# EAGLE design rpi_hat (EAGLE 6.6.0)
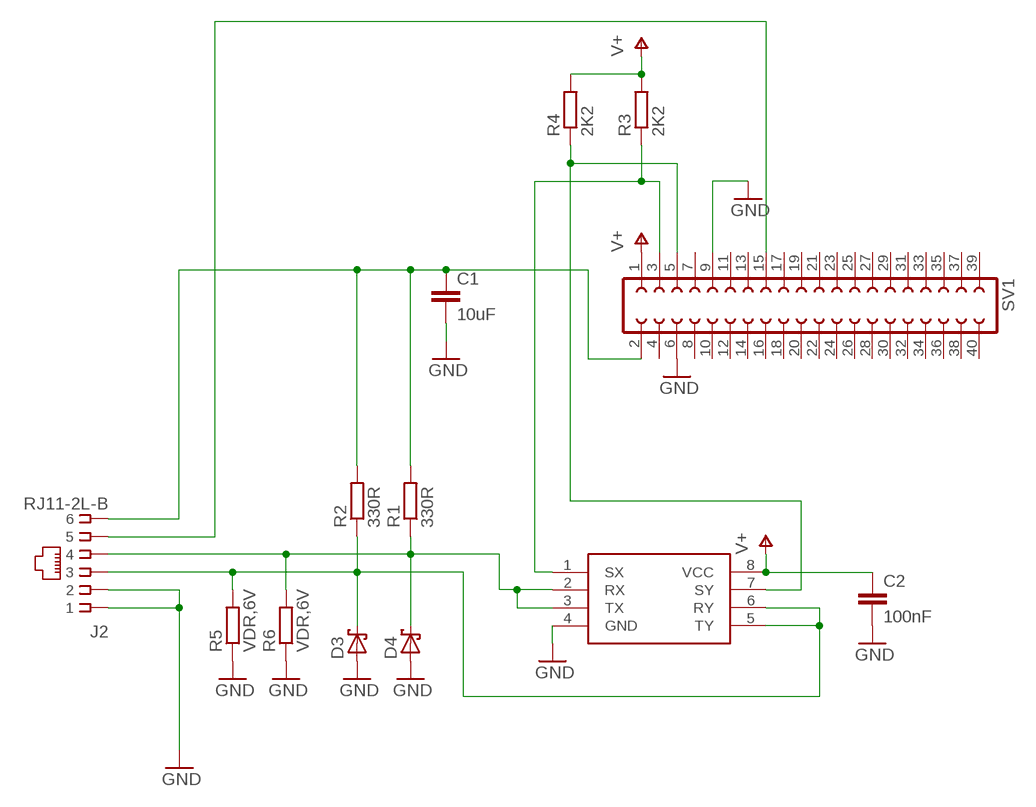
[diagram p0: schematic, sheet 1]

## Parts
C1  10uF  C-EUC0805  [C0805]
C2  100nF  C-EUC0805  [C0805]
D3  SCHOTTKY-DIODE  [DIODE_SMB]
D4  SCHOTTKY-DIODE  [DIODE_SMB]
J2  RJ11-2L-B  [RJ11-NO_SHIELD]
R1  330R  R-EU_R0805  [R0805]
R2  330R  R-EU_R0805  [R0805]
R3  2K2  R-EU_R0805  [R0805]
R4  2K2  R-EU_R0805  [R0805]
R5  VDR,6V  R-EU_R1206  [R1206]
R6  VDR,6V  R-EU_R1206  [R1206]
SV1  FE20-2  [FE20-2]
U$2  P82B96  [DIP8]

## Nets
GND: C1.2 C2.2 D3.A(C) D4.A(C) J2.1 J2.2 R5.1 R6.1 SV1.6 SV1.9 U$2.4(GND)
N$1: C1.1 J2.6 R1.2 R2.2 SV1.2
N$2: D4.C(A) J2.4 R1.1 R6.2 U$2.2(RX) U$2.3(TX)
N$3: J2.5 SV1.15
N$5: D3.C(A) J2.3 R2.1 R5.2 U$2.5(TY) U$2.6(RY)
SCL: R4.1 SV1.5 U$2.7(SY)
SDA: R3.1 SV1.3 U$2.1(SX)
V+: C2.1 R3.2 R4.2 SV1.1 U$2.8(VCC)
Unconnected: SV1.4 SV1.7 SV1.8 SV1.10 SV1.11 SV1.12 SV1.13 SV1.14 SV1.16 SV1.17 SV1.18 SV1.19 SV1.20 SV1.21 SV1.22 SV1.23 SV1.24 SV1.25 SV1.26 SV1.27 SV1.28 SV1.29 SV1.30 SV1.31 SV1.32 SV1.33 SV1.34 SV1.35 SV1.36 SV1.37 SV1.38 SV1.39 SV1.40

## Library data of the parts
C1 C2 = rcl:C-EU: CAPACITOR, European symbol
D3 D4 = eagle-ltspice:SCHOTTKY-DIODE: Schottky Diode; SPICEMODEL: NONE; SPICEPREFIX: D; SPICETYPE: diode
J2 = con-tycoelectronics:RJ11: CORCOM Modular RJ Jacks No Shield Source: www.tycoelectronics.com .. ENG_DS_1654001_1099_RJ_L_0507.pdf; MF: TYCO ELECTRONICS; MPN: RJ11-2L-B; OC_FARNELL: unknown; OC_NEWARK: 83F4463
R1-R6 = rcl:R-EU_: RESISTOR, European symbol
SV1 = con-lsta:FE20-2: FEMALE HEADER; OC_FARNELL: unknown; OC_NEWARK: unknown
U$2 = p82b96:P82B96

## Board
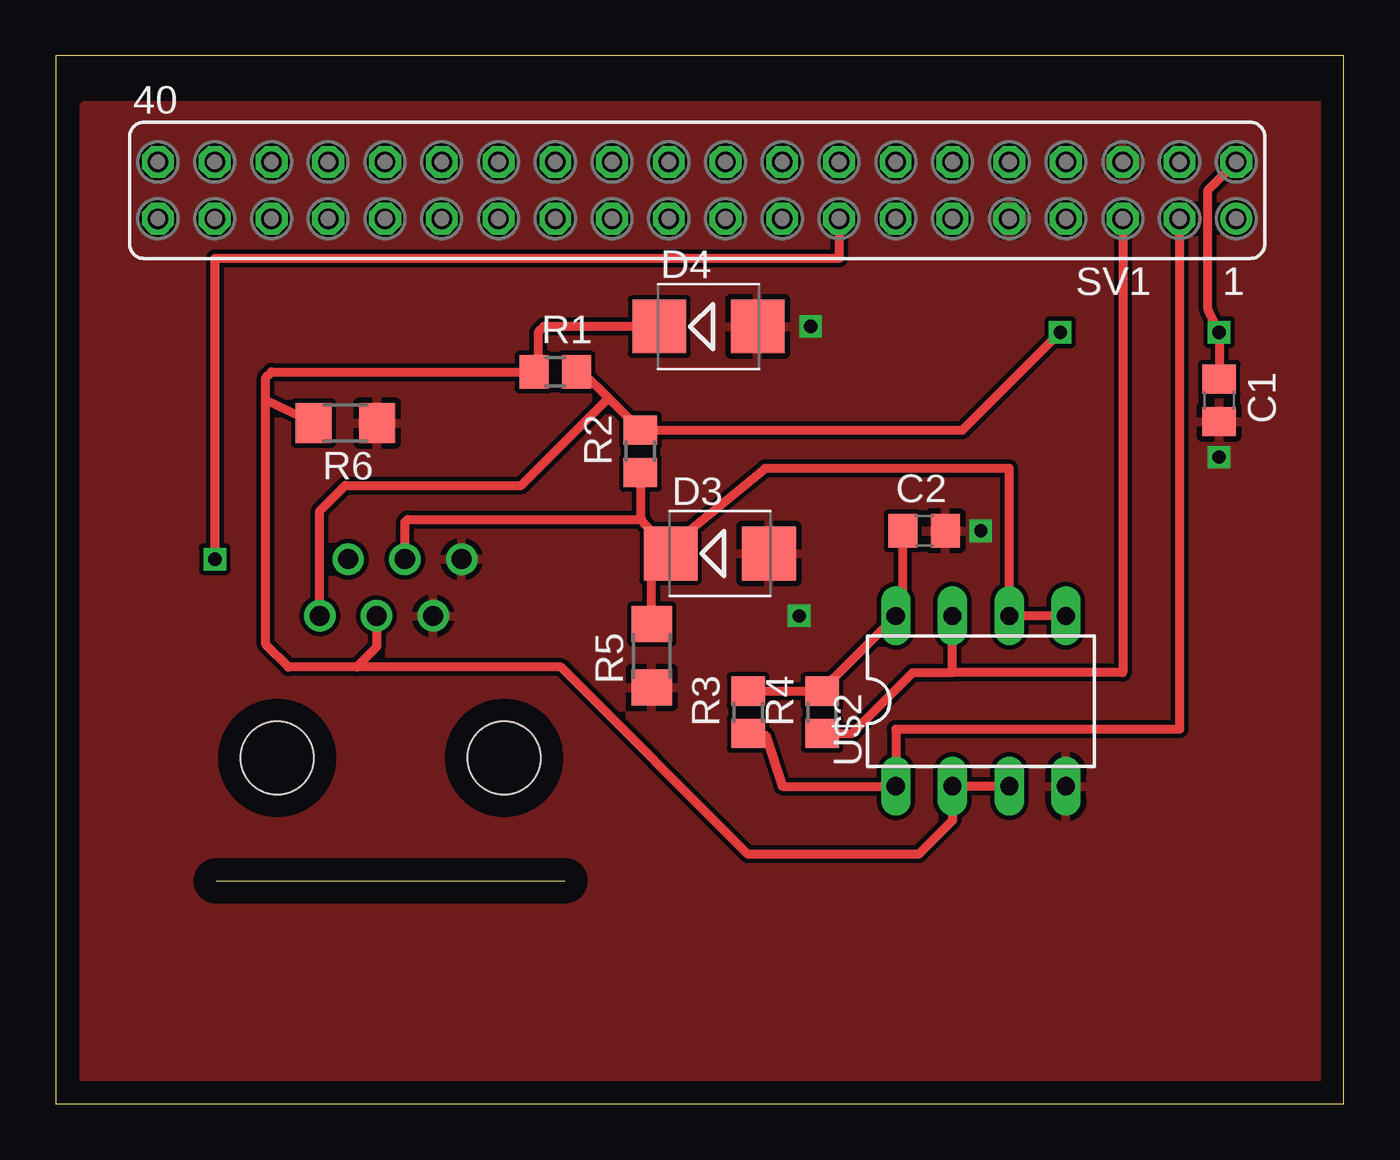
[diagram p1: board, top side]
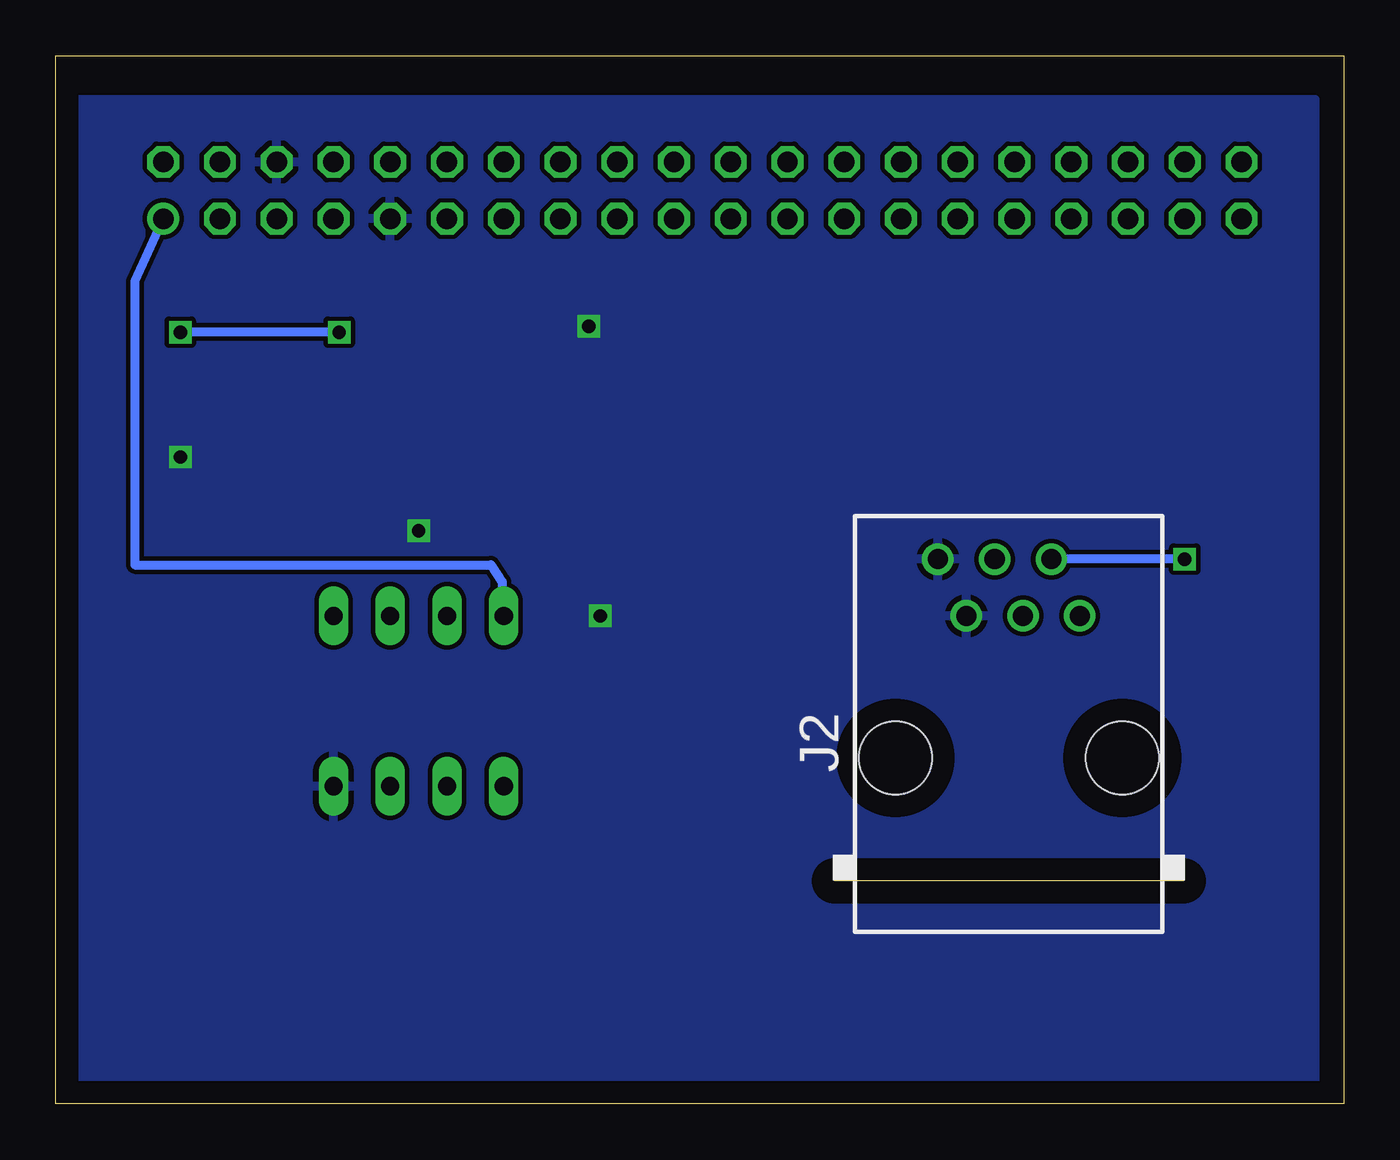
[diagram p2: board, bottom side, seen from below]

Size 57.64 x 46.91 mm. Coordinates in mm from the lower left corner, seen from the top.
Outline: 0,0 57.64,0 57.64,46.91 0,46.91 0,0
Copper layers (1*16): Top 0.035mm / dielectric 1.5mm / Bottom 0.035mm
Design rules "default": minimum track width 10mil, minimum drill 24mil, track to track 8mil, track to pad 8mil, pad to pad 8mil, via to via 8mil, smd to smd 8mil, copper to edge 40mil, drill to drill 8mil, minimum pad ring 10mil, minimum via ring 8mil, stop-mask expansion 4mil, vias tented up to drill 0mil, thermal gap 10mil

### Footprints (pad centres in the part's own frame; a part is rotated, then mirrored left to right if it is on the bottom)
C0805 = smd 1.3 x 1.5: 1 -0.95,0; 2 0.95,0
DIODE_SMB = smd 2.4 x 2.4: A 2.2,0; C -2.2,0
RJ11-NO_SHIELD = drill 0.9 pad 1.4: 1 -3.175,8.89; 2 -1.905,6.35; 3 -0.635,8.89; 4 0.635,6.35; 5 1.905,8.89; 6 3.175,6.35 | hole 3.251: -5.08,0; 5.08,0
R0805 = smd 1.3 x 1.5: 1 -0.95,0; 2 0.95,0
R1206 = smd 1.6 x 1.803: 1 -1.422,0; 2 1.422,0
FE20-2 = drill 0.914: 1 -24.13,1.27 | drill 0.914 octagon: 2 -24.13,-1.27; 3 -21.59,1.27; 4 -21.59,-1.27; 5 -19.05,1.27; 6 -19.05,-1.27; 7 -16.51,1.27; 8 -16.51,-1.27; 9 -13.97,1.27; 10 -13.97,-1.27; 11 -11.43,1.27; 12 -11.43,-1.27; 13 -8.89,1.27; 14 -8.89,-1.27; 15 -6.35,1.27; 16 -6.35,-1.27; 17 -3.81,1.27; 18 -3.81,-1.27; 19 -1.27,1.27; 20 -1.27,-1.27; 21 1.27,1.27; 22 1.27,-1.27; 23 3.81,1.27; 24 3.81,-1.27; 25 6.35,1.27; 26 6.35,-1.27; 27 8.89,1.27; 28 8.89,-1.27; 29 11.43,1.27; 30 11.43,-1.27; 31 13.97,1.27; 32 13.97,-1.27; 33 16.51,1.27; 34 16.51,-1.27; 35 19.05,1.27; 36 19.05,-1.27; 37 21.59,1.27; 38 21.59,-1.27; 39 24.13,1.27; 40 24.13,-1.27
DIP8 = drill 0.813 long: 1 -2.54,-3.81; 2 0,-3.81; 3 2.54,-3.81; 4 5.08,-3.81; 5 5.08,3.81; 6 2.54,3.81; 7 0,3.81; 8 -2.54,3.81

### Placement (x,y rotation side)
C1  52.07,31.5 270 top
C2  38.86,25.65 0 top
D3  29.72,24.64 0 top
D4  29.21,34.8 0 top
J2  14.99,15.49 0 bottom
R1  22.35,32.77 0 top
R2  26.16,29.21 90 top
R3  30.99,17.53 90 top
R4  34.29,17.53 90 top
R5  26.67,20.07 90 top
R6  12.95,30.48 180 top
SV1  28.7,40.89 180 top
U$2  40.13,18.03 0 top

### Tracks (layer width: path | path; a pad name or v marks a point on that pad's centre or on a via)
GND  (via drill 0.6)
  other vias: 33.27,21.84 52.07,28.96 41.4,25.65 33.78,34.8
  pour Top: 1.27,44.7 57.15,44.7 57.15,0 1.27,0
  pour Bottom: 1.27,44.96 57.15,44.96 57.15,0 1.27,0
N$1  (via drill 0.6)
  Top 0.406: R1.2 23.56,32.77 24.73,31.59 | 24.73,31.59 R2.2 40.57,30.16 v44.96,34.54 | C1.1 v52.07,34.54 51.56,35.56 51.56,40.89 SV1.2 | J2.6 11.81,26.54 12.95,27.69 20.83,27.69 24.73,31.59
  Bottom 0.406: v44.96,34.54 v52.07,34.54
N$2
  Top 0.406: U$2.3 U$2.2 40.13,12.7 38.61,11.18 30.99,11.18 22.61,19.56 13.46,19.56 | D4.C 21.84,34.8 21.59,34.54 21.59,32.95 R1.1 9.65,32.77 9.4,32.51 9.4,31.5 | J2.4 14.35,20.45 13.46,19.56 | 13.46,19.56 10.41,19.56 9.4,20.57 9.4,31.5 | R6.2 9.4,31.5
N$3  (via drill 0.6)
  Top 0.406: SV1.15 35.05,37.85 7.11,37.85 v7.11,24.38
  Bottom 0.406: v7.11,24.38 J2.5
N$5
  Top 0.406: U$2.5 U$2.6 42.67,28.45 31.75,28.45 27.43,24.89 | 27.43,24.89 26.67,24.13 | 26.67,24.13 26.92,24.55 D3.C | 26.16,26.29 26.29,26.04 27.43,24.89 | R2.1 26.16,26.29 | 26.16,26.29 26.16,26.16 15.75,26.16 15.62,26.04 J2.3 | R5.2 26.67,24.13
SCL
  Top 0.406: SV1.5 47.75,19.3 40.13,19.3 | 40.13,19.3 U$2.7 | R4.1 35.63,16.58 38.35,19.3 40.13,19.3
SDA
  Top 0.406: SV1.3 50.29,16.76 37.59,16.76 U$2.1 32.51,14.22 31.75,16.51 R3.1
V+
  Top 0.406: C2.1 37.91,22.16 U$2.8 34.8,19.05 R4.2 R3.2
  Bottom 0.406: SV1.1 54.1,36.83 54.1,24.13 38.17,24.13 37.66,23.37 37.66,22.16 U$2.8